# EAGLE design FlexPiece (EAGLE 9.5.1)
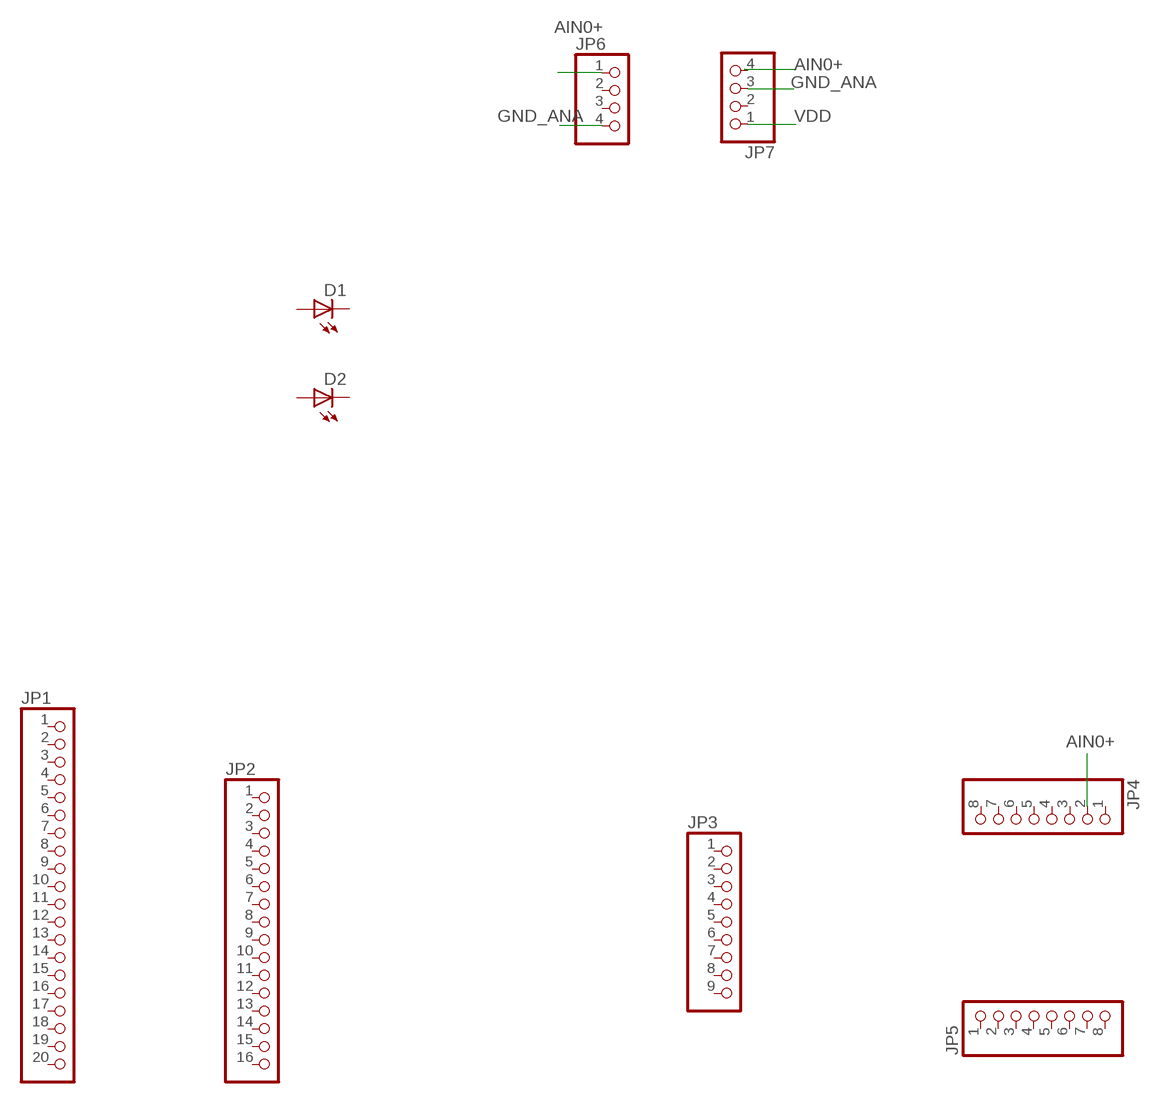
[diagram p0: schematic, sheet 1]

## Parts
D1  LED1206  [LED-1206]
D2  LED1206  [LED-1206]
JP1  PINHD-1X20  [1X20]
JP2  PINHD-1X16  [1X16]
JP3  PINHD-1X9  [1X09]
JP4  PINHD-1X8  [1X08]
JP5  PINHD-1X8  [1X08]
JP6  PINHD-1X4  [1X04]
JP7  PINHD-1X4  [1X04]

## Nets
AIN0+: JP4.2 JP6.1 JP7.4
GND_ANA: JP6.4 JP7.3
VDD: JP7.1
Unconnected: D1.A D1.C D2.A D2.C JP1.1 JP1.2 JP1.3 JP1.4 JP1.5 JP1.6 JP1.7 JP1.8 JP1.9 JP1.10 JP1.11 JP1.12 JP1.13 JP1.14 JP1.15 JP1.16 JP1.17 JP1.18 JP1.19 JP1.20 JP2.1 JP2.2 JP2.3 JP2.4 JP2.5 JP2.6 JP2.7 JP2.8 JP2.9 JP2.10 JP2.11 JP2.12 JP2.13 JP2.14 JP2.15 JP2.16 JP3.1 JP3.2 JP3.3 JP3.4 JP3.5 JP3.6 JP3.7 JP3.8 JP3.9 JP4.1 JP4.3 JP4.4 JP4.5 JP4.6 JP4.7 JP4.8 JP5.1 JP5.2 JP5.3 JP5.4 JP5.5 JP5.6 JP5.7 JP5.8 JP6.2 JP6.3 JP7.2

## Library data of the parts
D1 D2 = umich:LED: LEDs Standard schematic elements and footprints for 5mm, 3mm, 1206, and 0603 sized LEDs. 5mm - Spark Fun Electronics SKU : COM-00529 (and others)
JP1 = adafruit:PINHD-1X20: PIN HEADER
JP2 = pinhead:PINHD-1X16: PIN HEADER
JP3 = pinhead:PINHD-1X9: PIN HEADER
JP4 JP5 = pinhead:PINHD-1X8: PIN HEADER
JP6 JP7 = pinhead:PINHD-1X4: PIN HEADER

## Board
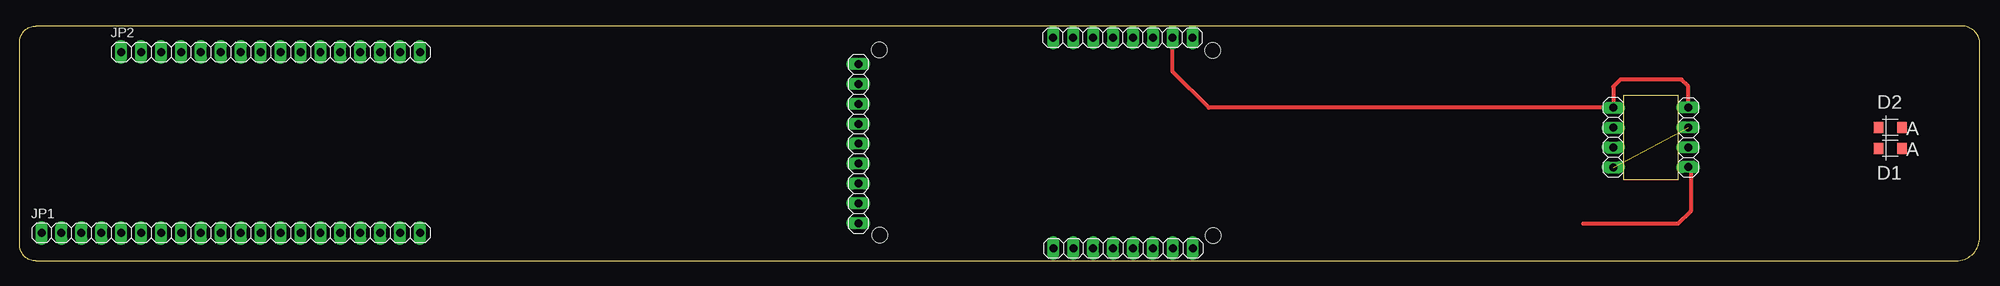
[diagram p1: board, top side]

Size 249.94 x 29.97 mm. Coordinates in mm from the lower left corner, seen from the top.
Outline: 2.03,0 arc-90 0,2.03 0,27.94 arc-90 2.03,29.97 247.65,29.97 arc-90 249.94,27.69 249.94,3.05 arc-90 246.89,0 2.03,0
Outline: 204.47,10.41 211.48,10.41 211.48,21.13 204.47,21.13 204.47,10.41
Copper layers (1*16): Top 0.035mm / dielectric 1.5mm / Bottom 0.035mm
Design rules "default": minimum track width 6mil, minimum drill 0.35mm, track to track 6mil, track to pad 6mil, pad to pad 6mil, via to via 6mil, smd to smd 6mil, copper to edge 40mil, drill to drill 6mil, minimum pad ring 10mil, minimum via ring 8mil, stop-mask expansion 4mil, vias tented up to drill 0mil, thermal gap 10mil
Holes 2 mm at 109.63,26.95 109.65,3.3 152.17,3.25 152.15,26.9

### Footprints (pad centres in the part's own frame; a part is rotated, then mirrored left to right if it is on the bottom)
LED-1206 = smd 1.2 x 1.4: A -1.5,0; C 1.5,0
1X20 = drill 1.016 long: 1 -24.13,0; 2 -21.59,0; 3 -19.05,0; 4 -16.51,0; 5 -13.97,0; 6 -11.43,0; 7 -8.89,0; 8 -6.35,0; 9 -3.81,0; 10 -1.27,0; 11 1.27,0; 12 3.81,0; 13 6.35,0; 14 8.89,0; 15 11.43,0; 16 13.97,0; 17 16.51,0; 18 19.05,0; 19 21.59,0; 20 24.13,0
1X16 = drill 1.016 long: 1 -19.05,0; 2 -16.51,0; 3 -13.97,0; 4 -11.43,0; 5 -8.89,0; 6 -6.35,0; 7 -3.81,0; 8 -1.27,0; 9 1.27,0; 10 3.81,0; 11 6.35,0; 12 8.89,0; 13 11.43,0; 14 13.97,0; 15 16.51,0; 16 19.05,0
1X09 = drill 1.016 long: 1 -10.16,0; 2 -7.62,0; 3 -5.08,0; 4 -2.54,0; 5 0,0; 6 2.54,0; 7 5.08,0; 8 7.62,0; 9 10.16,0
1X08 = drill 1.016 long: 1 -8.89,0; 2 -6.35,0; 3 -3.81,0; 4 -1.27,0; 5 1.27,0; 6 3.81,0; 7 6.35,0; 8 8.89,0
1X04 = drill 1.016 long: 1 -3.81,0; 2 -1.27,0; 3 1.27,0; 4 3.81,0

### Placement (x,y rotation side)
D1  238.49,14.36 180 top
D2  238.49,17.01 180 top
JP1  26.92,3.56 0 top
JP2  32,26.67 0 top
JP3  106.93,14.96 90 top
JP4  140.67,28.52 180 top
JP5  140.69,1.63 0 top
JP6  203.2,15.75 270 top
JP7  212.75,15.77 90 top

### Tracks (layer width: path | path; a pad name or v marks a point on that pad's centre or on a via)
AIN0+
  Top 0.508: JP4.2 147.01,24.18 151.64,19.56 JP6.1 203.2,22.25 204.11,23.16 211.89,23.16 212.75,22.3 JP7.4
GND_ANA  (1 unrouted)
VDD
  Top 0.508: JP7.1 213.06,11.66 213.06,6.35 211.45,4.75 199.34,4.75